# EAGLE design RelaysBoard (EAGLE 7.2.0)
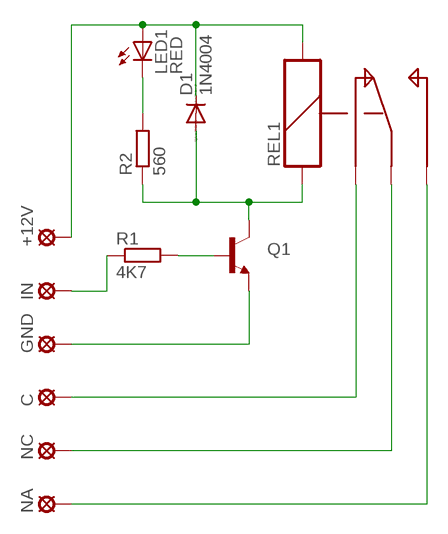
[diagram p0: schematic, sheet 1]

## Parts
+12V  LSP10  [LSP10]
C  LSP10  [LSP10]
D1  1N4004  [DO41-10]
GND  LSP10  [LSP10]
IN  LSP10  [LSP10]
LED1  RED  LED5MM  [LED5MM]
NA  LSP10  [LSP10]
NC  LSP10  [LSP10]
Q1  TRANSISTOR_NPNBC547  [TO-92-AMMO]
R1  4K7  R-EU_0207/12  [0207/12]
R2  560  R-EU_0207/10  [0207/10]
REL1  REL-5PIN  [REL-5PIN]

## Nets
N$1: +12V.MP D1.C LED1.A REL1.S2
N$2: D1.A Q1.1(C) R2.1 REL1.S1
N$3: Q1.2(B) R1.2
N$4: LED1.K(C) R2.2
N$5: GND.MP Q1.3(E)
N$6: C.MP REL1.S
N$7: NC.MP REL1.C
N$8: NA.MP REL1.O
N$9: IN.MP R1.1

## Library data of the parts
+12V C GND IN NA NC = solpad:LSP10: SOLDER PAD drill 1.0 mm, distributor Buerklin, 12H555
D1 = diode:1N4004: DIODE general purpose rectifier, 1 A
LED1 = led:LED: LED OSRAM: - CHIPLED LG R971, LG N971, LY N971, LG Q971, LY Q971, LO R971, LY R971 LH N974, LH R974 LS Q976, LO Q976, LY Q976 LO Q996 - Hyper CHIPLED LW Q18S LB Q993, LB Q99A, LB R99A - SideLED LS A670, LO A670, LY A670, LG A670, LP A670 LB A673, LV A673, LT A673, LW A673 LH A674 LY A675 LS A676, LA A676, LO A676, LY A676, LW A676 LS A679, LY A679, LG A679 - Hyper Micro SIDELED® LS Y876, LA Y876, LO Y876, LY Y876 LT Y87S - SmartLED LW L88C, LW L88S LB L89C, LB L89S, LG L890 LS L89K, LO L89K, LY L89K LS L896, LA L896, LO L896, LY L896 - TOPLED LS T670, LO T670, LY T670, LG T670, LP T670 LSG T670, LSP T670, LSY T670, LOP T670, LYG T670 LG T671, LOG T671, LSG T671 LB T673, LV T673, LT T673, LW T673 LH T674 LS T676, LA T676, LO T676, LY T676, LB T676, LH T676, LSB T676, LW T676 LB T67C, LV T67C, LT T67C, LS T67K, LO T67K, LY T67K, LW E67C LS E67B, LA E67B, LO E67B, LY E67B, LB E67C, LV E67C, LT E67C LW T67C LS T679, LY T679, LG T679 LS T770, LO T770, LY T770, LG T770, LP T770 LB T773, LV T773, LT T773, LW T773 LH T774 LS E675, LA E675, LY E675, LS T675 LS T776, LA T776, LO T776, LY T776, LB T776 LHGB T686 LT T68C, LB T68C - Hyper Mini TOPLED® LB M676 - Mini TOPLED Santana® LG M470 LS M47K, LO M47K, LY M47K Source: http://www.osram.convergy.de LUXEON: - LUMILED® LXK2-PW12-R00, LXK2-PW12-S00, LXK2-PW14-U00, LXK2-PW14-V00 LXK2-PM12-R00, LXK2-PM12-S00, LXK2-PM14-U00 LXK2-PE12-Q00, LXK2-PE12-R00, LXK2-PE12-S00, LXK2-PE14-T00, LXK2-PE14-U00 LXK2-PB12-K00, LXK2-PB12-L00, LXK2-PB12-M00, LXK2-PB14-N00, LXK2-PB14-P00, LXK2-PB14-Q00 LXK2-PR12-L00, LXK2-PR12-M00, LXK2-PR14-Q00, LXK2-PR14-R00 LXK2-PD12-Q00, LXK2-PD12-R00, LXK2-PD12-S00 LXK2-PH12-R00, LXK2-PH12-S00 LXK2-PL12-P00, LXK2-PL12-Q00, LXK2-PL12-R00 Source: www.luxeon.com KINGBRIGHT: KA-3528ASYC Source: www.kingbright.com
Q1 = SparkFun-DiscreteSemi:TRANSISTOR_NPN: Generic NPN BJT MMBT2222A - TRANS-08049 (SOT-23, 1A 40V) MPSA42 - TRANS-09116 (SOT-23, 500mA 300V) MMBT5088LT1G - TRANS-11160 (SOT-23, 50 mA 30V) BC547 - COM-08928 <http://www.sparkfun.com/products/8928> (TO-92 45V 100mA) (1.Collector 2.Base 3.Emitter) 2N3904 - COM-00521 <http://www.sparkfun.com/products/521> (TO-92 40V 200mA) (1.Emitter 2.Base 3.Collector) P2N2222A - COM-12852 <http://www.sparkfun.com/products/12852> (TO-92 40V 600mA) (1.Collector 2.Base 3.Emitter)
R1 = rcl:R-EU_: RESISTOR, European symbol
R2 = resistor:R-EU_: RESISTOR, European symbol
REL1 = special:REL-5PIN: RELAY

## Board
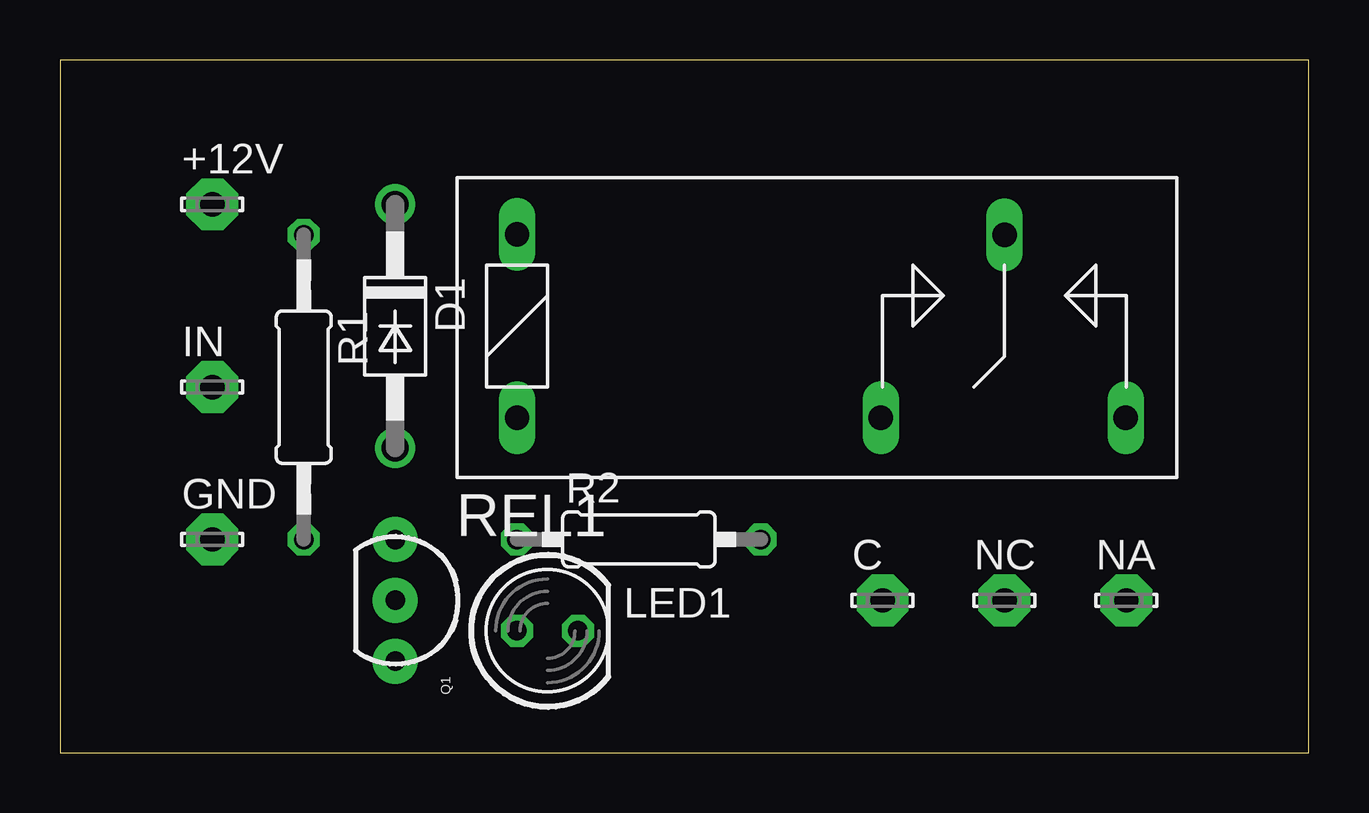
[diagram p1: board, top side]
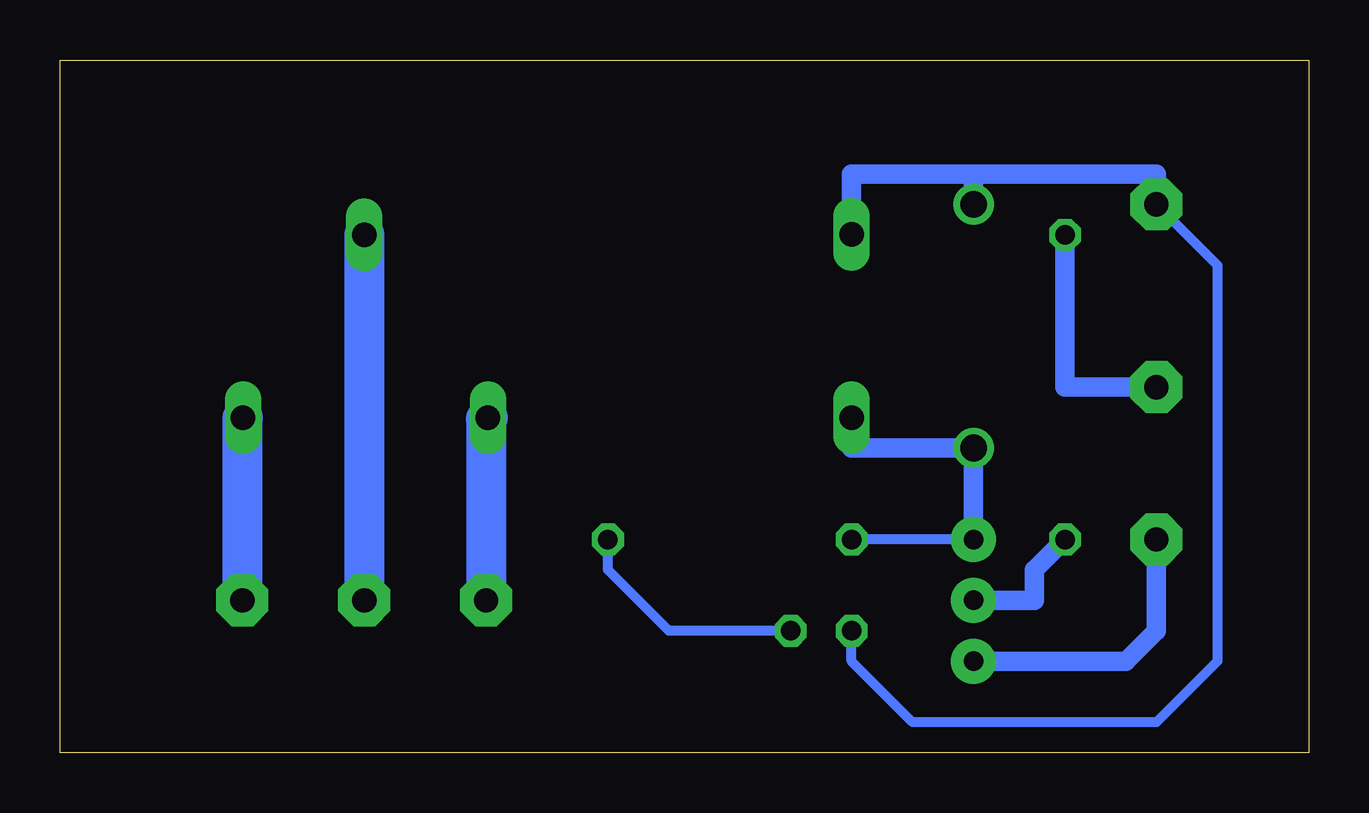
[diagram p2: board, bottom side, seen from below]

Size 52.05 x 28.88 mm. Coordinates in mm from the lower left corner, seen from the top.
Outline: 0,0 52.05,0 52.05,28.88 0,28.88 0,0
Copper layers (1*16): Top 0.035mm / dielectric 1.5mm / Bottom 0.035mm
Design rules "default": minimum track width 10mil, minimum drill 24mil, track to track 8mil, track to pad 8mil, pad to pad 8mil, via to via 8mil, smd to smd 8mil, copper to edge 40mil, drill to drill 8mil, minimum pad ring 10mil, minimum via ring 8mil, stop-mask expansion 4mil, vias tented up to drill 0mil, thermal gap 10mil

### Footprints (pad centres in the part's own frame; a part is rotated, then mirrored left to right if it is on the bottom)
LSP10 = drill 1.016 pad 2.159 octagon: MP 0,0
DO41-10 = drill 1.118: A 5.08,0; C -5.08,0
LED5MM = drill 0.813 octagon: A -1.27,0; K 1.27,0
TO-92-AMMO = drill 0.813 pad 1.88: 1 -2.54,0; 2 0,0; 3 2.54,0
0207/12 = drill 0.813 octagon: 1 -6.35,0; 2 6.35,0
0207/10 = drill 0.813 octagon: 1 -5.08,0; 2 5.08,0
REL-5PIN = drill 1.016 long: C 8.89,3.81; O 13.945,-3.81; S 3.734,-3.81; S1 -11.43,-3.81; S2 -11.43,3.835

### Placement (x,y rotation side)
+12V  6.35,22.86 0 top
C  34.29,6.35 0 top
D1  13.97,17.78 270 top
GND  6.35,8.89 0 top
IN  6.35,15.24 0 top
LED1  20.32,5.08 0 top
NA  44.45,6.35 0 top
NC  39.37,6.35 0 top
Q1  13.97,6.35 270 top
R1  10.16,15.24 270 top
R2  24.13,8.89 0 top
REL1  30.48,17.78 0 top

### Tracks (layer width: path | path; a pad name or v marks a point on that pad's centre or on a via)
N$1
  Bottom 0.406: +12V.MP 3.81,20.32 3.81,3.81 6.35,1.27 16.51,1.27 19.05,3.81 LED1.A
  Bottom 0.813: REL1.S2 19.05,24.13 13.97,24.13 | 13.97,24.13 6.35,24.13 +12V.MP | D1.C 13.97,24.13
N$2
  Bottom 0.406: Q1.1 R2.1
  Bottom 0.813: Q1.1 D1.A 19.05,12.7 REL1.S1
N$3
  Bottom 0.813: R1.2 11.43,7.62 11.43,6.35 Q1.2
N$4
  Bottom 0.406: LED1.K 26.67,5.08 29.21,7.62 R2.2
N$5
  Bottom 0.813: GND.MP 6.35,5.08 7.62,3.81 Q1.3
N$6
  Bottom 1.676: REL1.S 34.29,13.89 C.MP
N$7
  Bottom 1.676: REL1.C NC.MP
N$8
  Bottom 1.676: REL1.O 44.45,13.95 NA.MP
N$9
  Bottom 0.813: R1.1 10.16,15.24 IN.MP